# Altium schematic sheet arduino due connection.SchDoc
size A4
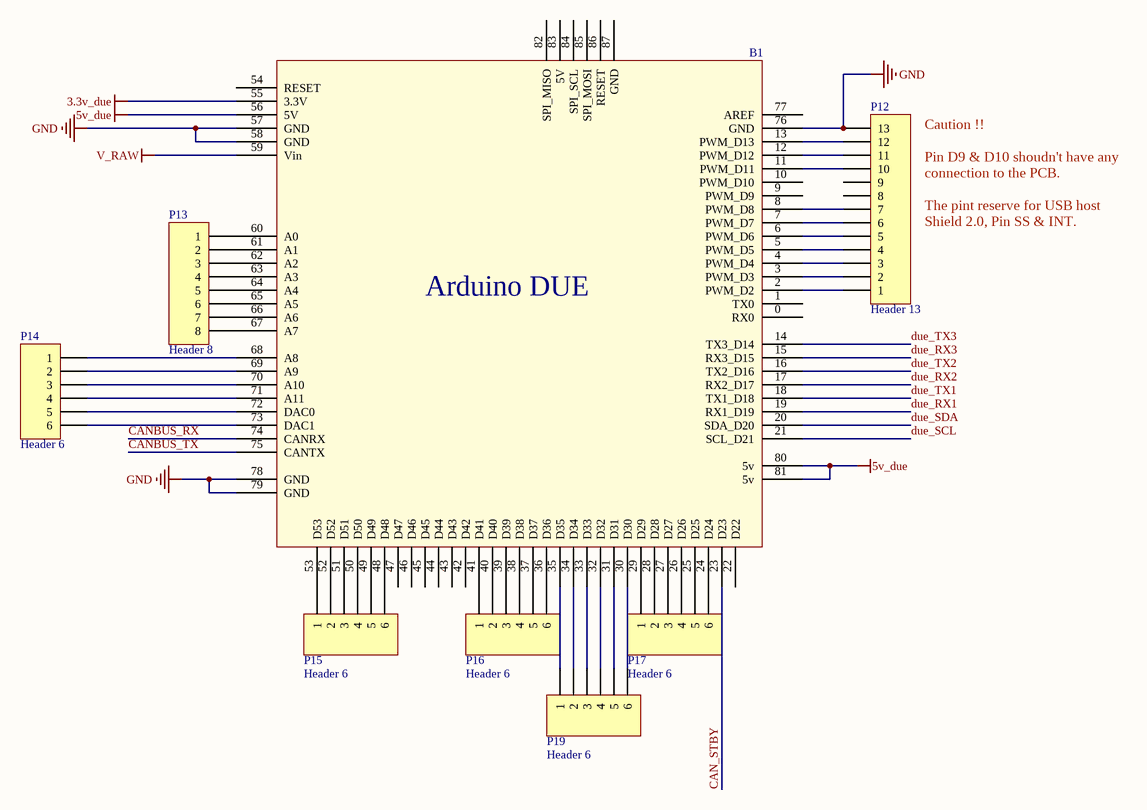
[diagram p0: arduino due connection.SchDoc]

## Parts
B1  Arduino due  [arduino_due_pinmap_v3]  (value not drawn)
P12  Header 13  [HDR1X13]
P13  Header 8  [HDR1X8]
P14  Header 6  [HDR1X6]
P15  Header 6  [HDR1X6]
P16  Header 6  [HDR1X6]
P17  Header 6  [HDR1X6]
P19  Header 6  [HDR1X6]

## Nets
3.3v_due: B1.55(3.3V)
5v_due: B1.56(5V) B1.80(5v) B1.81(5v)
GND: B1.57(GND) B1.58(GND) B1.76(GND) B1.78(GND) B1.79(GND) P12.13
V_RAW: B1.59(Vin)
CAN_STBY: B1.23(D23)
CANBUS_RX: B1.74(CANRX)
CANBUS_TX: B1.75(CANTX)
due_RX1: B1.19(RX1_D19)
due_RX2: B1.17(RX2_D17)
due_RX3: B1.15(RX3_D15)
due_SCL: B1.21(SCL_D21)
due_SDA: B1.20(SDA_D20)
due_TX1: B1.18(TX1_D18)
due_TX2: B1.16(TX2_D16)
due_TX3: B1.14(TX3_D14)
NetB1_2: B1.2(PWM_D2) P12.1
NetB1_3: B1.3(PWM_D3) P12.2
NetB1_4: B1.4(PWM_D4) P12.3
NetB1_5: B1.5(PWM_D5) P12.4
NetB1_6: B1.6(PWM_D6) P12.5
NetB1_7: B1.7(PWM_D7) P12.6
NetB1_8: B1.8(PWM_D8) P12.7
NetB1_11: B1.11(PWM_D11) P12.10
NetB1_12: B1.12(PWM_D12) P12.11
NetB1_13: B1.13(PWM_D13) P12.12
NetB1_24: B1.24(D24) P17.6
NetB1_25: B1.25(D25) P17.5
NetB1_26: B1.26(D26) P17.4
NetB1_27: B1.27(D27) P17.3
NetB1_28: B1.28(D28) P17.2
NetB1_29: B1.29(D29) P17.1
NetB1_30: B1.30(D30) P19.6
NetB1_31: B1.31(D31) P19.5
NetB1_32: B1.32(D32) P19.4
NetB1_33: B1.33(D33) P19.3
NetB1_34: B1.34(D34) P19.2
NetB1_35: B1.35(D35) P19.1
NetB1_36: B1.36(D36) P16.6
NetB1_37: B1.37(D37) P16.5
NetB1_38: B1.38(D38) P16.4
NetB1_39: B1.39(D39) P16.3
NetB1_40: B1.40(D40) P16.2
NetB1_41: B1.41(D41) P16.1
NetB1_48: B1.48(D48) P15.6
NetB1_49: B1.49(D49) P15.5
NetB1_50: B1.50(D50) P15.4
NetB1_51: B1.51(D51) P15.3
NetB1_52: B1.52(D52) P15.2
NetB1_53: B1.53(D53) P15.1
NetB1_60: B1.60(A0) P13.1
NetB1_61: B1.61(A1) P13.2
NetB1_62: B1.62(A2) P13.3
NetB1_63: B1.63(A3) P13.4
NetB1_64: B1.64(A4) P13.5
NetB1_65: B1.65(A5) P13.6
NetB1_66: B1.66(A6) P13.7
NetB1_67: B1.67(A7) P13.8
NetB1_68: B1.68(A8) P14.1
NetB1_69: B1.69(A9) P14.2
NetB1_70: B1.70(A10) P14.3
NetB1_71: B1.71(A11) P14.4
NetB1_72: B1.72(DAC0) P14.5
NetB1_73: B1.73(DAC1) P14.6

Not connected (* = marked no-connect by the designer): B1 0(RX0) 1(TX0) 9(PWM_D9) 10(PWM_D10) 22(D22) 42(D42) 43(D43) 44(D44) 45(D45) 46(D46) 47(D47) 54(RESET) 77(AREF) 82(SPI_MISO) 83(5V) 84(SPI_SCL) 85(SPI_MOSI) 86(RESET) 87(GND); P12 8 9

## Notes on the sheet
- Caution !!
  Pin D9 & D10 shoudn't have any connection to the PCB.
  The pint reserve for USB host Shield 2.0, Pin SS & INT.
- (in symbol arduino due) Arduino DUE

## Library data of the parts
P12 = Header 13: Header, 13-Pin; LatestRevisionDate: 17-Jul-2002; LatestRevisionNote: Re-released for DXP Platform.; Publisher: Altium Limited
P13 = Header 8: Header, 8-Pin; LatestRevisionDate: 17-Jul-2002; LatestRevisionNote: Re-released for DXP Platform.; Publisher: Altium Limited
P14-P17 P19 = Header 6: Header, 6-Pin; LatestRevisionDate: 17-Jul-2002; LatestRevisionNote: Re-released for DXP Platform.; Publisher: Altium Limited